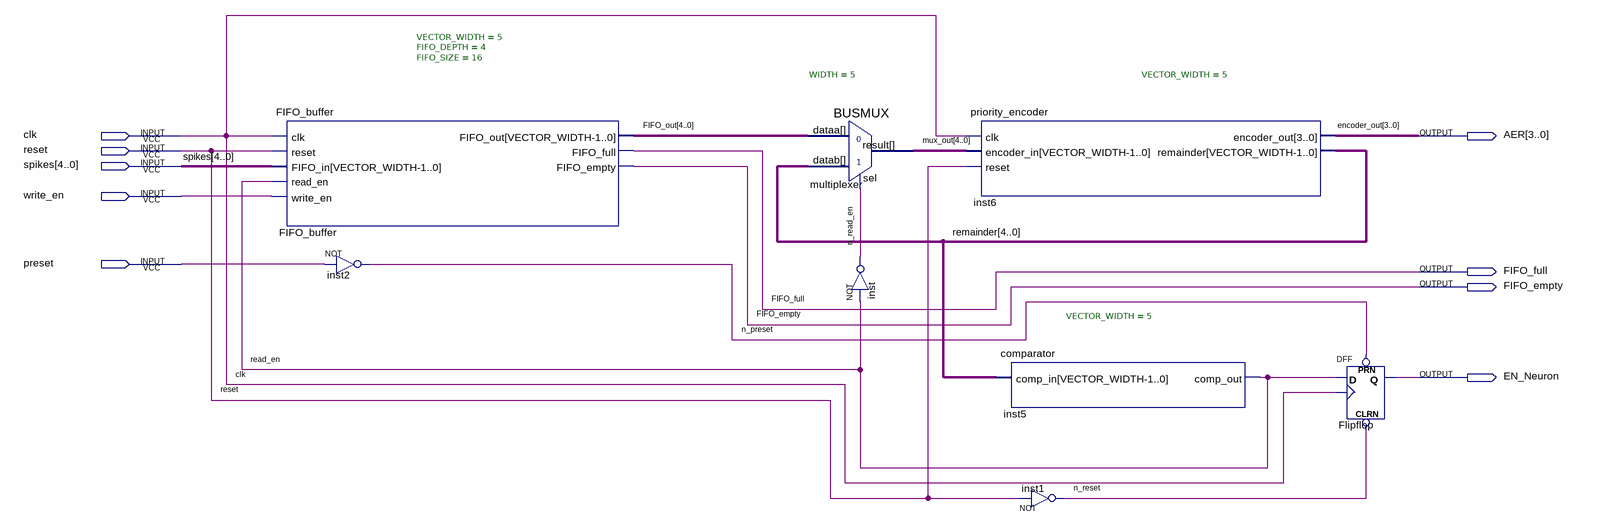
[diagram p0: schematic sheet]
// Quartus schematic aer_design_file.bdf as structural Verilog: 8 symbols, 9 pins
module aer_design_file (
  input  clk,
  input  reset,
  input  [4:0] spikes,
  input  write_en,
  input  preset,
  output [3:0] AER,
  output FIFO_full,
  output FIFO_empty,
  output EN_Neuron
);

  wire n_preset, n_read_en, n_reset, read_en;
  wire [4:0] FIFO_out, mux_out, remainder;

  FIFO_buffer #(.VECTOR_WIDTH(5), .FIFO_DEPTH(4), .FIFO_SIZE(16)) FIFO_buffer (
    .clk(clk), .reset(reset), .FIFO_in(spikes), .read_en(read_en), .write_en(write_en), .FIFO_out(FIFO_out),
    .FIFO_full(FIFO_full), .FIFO_empty(FIFO_empty));
  not inst2 (n_preset, preset);
  BUSMUX #(.WIDTH(5)) multiplexer (.datab(remainder), .sel(n_read_en), .dataa(FIFO_out), .result(mux_out));
  not inst (n_read_en, read_en);
  priority_encoder #(.VECTOR_WIDTH(5)) inst6 (
    .clk(clk), .encoder_in(mux_out), .reset(reset), .encoder_out(AER), .remainder(remainder));
  comparator #(.VECTOR_WIDTH(5)) inst5 (.comp_in(remainder), .comp_out(read_en));
  not inst1 (n_reset, reset);
  DFF Flipflop (.CLRN(n_reset), .CLK(clk), .D(read_en), .PRN(n_preset), .Q(EN_Neuron));

  // Other names for the same wires on the sheet: encoder_out[3:0] = AER
endmodule
